# Altium schematic sheet servoUSBrev0.SCHDOC
size A; Author: T Delbruck; CompanyName: INI; DrawnBy: T Delbruck; Engineer: T Delbruck; Organization: INI; Address1: tobi@ini.phys.ethz.ch; DocumentName: SimpleMonitorUSBXPress
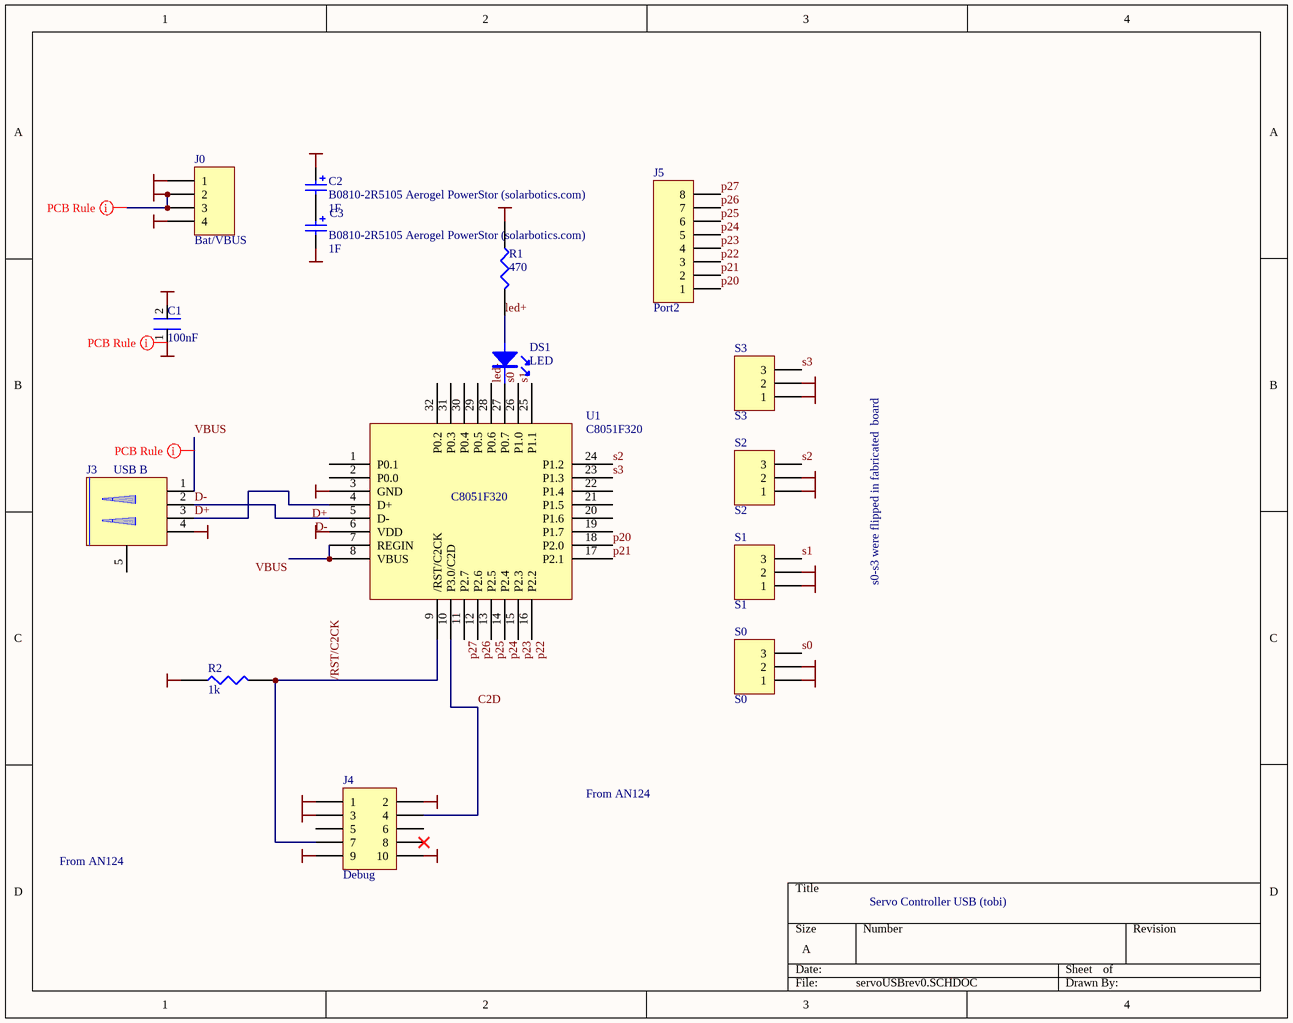
[diagram p0: servoUSBrev0.SCHDOC]

## Parts
C1  100nF  [CC2013-0805]
C2  B0810-2R5105 Aerogel PowerStor (solarbotics.com)  value 1F  [CAPPR3.5-8X10.5]
C3  B0810-2R5105 Aerogel PowerStor (solarbotics.com)  value 1F  [CAPPR3.5-8X10.5]
DS1  LED  [0805LED]
J0  Bat/VBUS  [HDR1X4]
J3  USB B  [usb]
J4  Debug  [HDR2X5]
J5  Port2  [HDR1X8]
R1  470  [CR2012-0805]
R2  1k  [CR2012-0805]
S0  S0  [HDR1X3]
S1  S1  [HDR1X3]
S2  S2  [HDR1X3]
S3  S3  [HDR1X3]
U1  C8051F320  [TQFP32]

## Nets
GND: C1.1 C3.2 J0.1 J3.4 J4.2 J4.3 J4.9 S0.1 S1.1 S2.1 S3.1 U1.3(GND)
SPOW: J0.2 J0.3 S0.2 S1.2 S2.2 S3.2
VBUS: C2.1 J0.4 J3.1 J4.10 U1.7(REGIN) U1.8(VBUS)
VDD: C1.2 J4.1 R1.1 R2.1 U1.6(VDD)
/RST/C2CK: J4.7 R2.2 U1.9(/RST/C2CK)
C2D: J4.4 U1.10(P3.0/C2D)
D+: J3.3 U1.4(D+)
D-: J3.2 U1.5(D-)
led+: DS1.+ R1.2
led-: DS1.- U1.27(P0.7)
p20: J5.1 U1.18(P2.0)
p21: J5.2 U1.17(P2.1)
p22: J5.3 U1.16(P2.2)
p23: J5.4 U1.15(P2.3)
p24: J5.5 U1.14(P2.4)
p25: J5.6 U1.13(P2.5)
p26: J5.7 U1.12(P2.6)
p27: J5.8 U1.11(P2.7)
s0: S0.3 U1.26(P1.0)
s1: S1.3 U1.25(P1.1)
s2: S2.3 U1.24(P1.2)
s3: S3.3 U1.23(P1.3)
NetC2_2: C2.2 C3.1

Not connected (* = marked no-connect by the designer): J3 5; J4 5 6 8*; U1 1(P0.1) 2(P0.0) 19(P1.7) 20(P1.6) 21(P1.5) 22(P1.4) 28(P0.6) 29(P0.5) 30(P0.4) 31(P0.3) 32(P0.2)

## Layout directives
rule Width Constraint [Pref Width = 20mil    Min Width = 10mil    Max Width = 60mil]: GND, SPOW, VBUS

## Notes on the sheet
- s0-s3 were flipped in fabricated  board
- From AN124
- Servo Controller USB (tobi)

## Library data of the parts
C1 = CAPCHIP
C2 C3 = Cap Pol1: Polarized Capacitor (Radial); Published: 8-Jun-2000; Revision: July-2002: Re-released for DXP Platform.; Publisher: Altium Limited
DS1 = LED: LED, SMT 3mm by 1.5mm
J0 = Header 4: Header, 4-Pin; Revision: 17-Jul-2002: Re-released for DXP Platform.; Publisher: Altium Limited
J3 = USB: USB TypB
J4 = Header 5X2: Header, 5-Pin, Dual row; Revision: 17-Jul-2002: Re-released for DXP Platform.; Publisher: Altium Limited
J5 = Header 8: Header, 8-Pin; Revision: 17-Jul-2002: Re-released for DXP Platform.; Publisher: Altium Limited
R1 R2 = RES1
S0-S3 = Header 3: Header, 3-Pin; Revision: 17-Jul-2002: Re-released for DXP Platform.; Publisher: Altium Limited
U1 = C8051F320: Silicon Labs USB Microcontroller